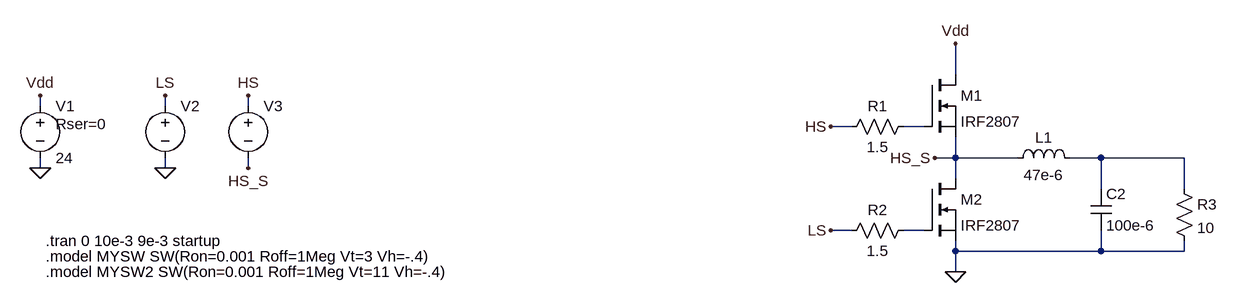
[diagram p0: schematic gate-driver-simple.asc]
gate-driver-simple.asc, the LTspice schematic file:
Version 4
SHEET 1 1408 680
WIRE 688 -272 688 -320
WIRE -720 -224 -720 -240
WIRE -528 -224 -528 -240
WIRE -400 -224 -400 -240
WIRE 528 -192 496 -192
WIRE 640 -192 608 -192
WIRE 688 -144 688 -176
WIRE 688 -144 656 -144
WIRE 784 -144 688 -144
WIRE 912 -144 864 -144
WIRE 1040 -144 912 -144
WIRE -720 -128 -720 -144
WIRE -528 -128 -528 -144
WIRE -400 -128 -400 -144
WIRE 688 -112 688 -144
WIRE 912 -96 912 -144
WIRE 1040 -96 1040 -144
WIRE 528 -32 496 -32
WIRE 640 -32 608 -32
WIRE 688 0 688 -16
WIRE 912 0 912 -32
WIRE 912 0 688 0
WIRE 1040 0 1040 -16
WIRE 1040 0 912 0
WIRE 688 32 688 0
FLAG 688 32 0
FLAG -720 -240 Vdd
FLAG -720 -128 0
FLAG 688 -320 Vdd
FLAG -528 -128 0
FLAG -528 -240 LS
FLAG -400 -240 HS
FLAG 496 -32 LS
FLAG 656 -144 HS_S
FLAG -400 -128 HS_S
FLAG 496 -192 HS
SYMBOL res 624 -208 R90
WINDOW 0 0 56 VBottom 2
WINDOW 3 32 56 VTop 2
SYMATTR InstName R1
SYMATTR Value 1.5
SYMBOL res 624 -48 R90
WINDOW 0 0 56 VBottom 2
WINDOW 3 32 56 VTop 2
SYMATTR InstName R2
SYMATTR Value 1.5
SYMBOL nmos 640 -272 R0
SYMATTR InstName M1
SYMATTR Value IRF2807
SYMBOL voltage -720 -240 R0
WINDOW 123 0 0 Left 0
WINDOW 39 24 44 Left 2
SYMATTR SpiceLine Rser=0
SYMATTR InstName V1
SYMATTR Value 24
SYMBOL res 1024 -112 R0
SYMATTR InstName R3
SYMATTR Value 10
SYMBOL ind 768 -128 R270
WINDOW 0 32 56 VTop 2
WINDOW 3 5 56 VBottom 2
SYMATTR InstName L1
SYMATTR Value 47e-6
SYMBOL cap 896 -96 R0
SYMATTR InstName C2
SYMATTR Value 100e-6
SYMBOL voltage -528 -240 R0
WINDOW 3 24 96 Invisible 2
WINDOW 123 0 0 Left 0
SYMATTR Value PULSE(12 0 0 1e-9 1e-9 5e-6 10e-6)
SYMATTR SpiceLine Rser=1e-3
SYMATTR InstName V2
SYMBOL voltage -400 -240 R0
WINDOW 3 24 96 Invisible 2
WINDOW 123 0 0 Left 0
SYMATTR Value PULSE(0 12 0.1e-6 0.1e-9 0.1e-9 4.8e-6 10e-6)
SYMATTR SpiceLine Rser=1e-3
SYMATTR InstName V3
SYMBOL nmos 640 -112 R0
SYMATTR InstName M2
SYMATTR Value IRF2807
TEXT -712 -16 Left 2 !.tran 0 10e-3 9e-3 startup
TEXT -712 8 Left 2 !.model MYSW SW(Ron=0.001 Roff=1Meg Vt=3 Vh=-.4)
TEXT -712 32 Left 2 !.model MYSW2 SW(Ron=0.001 Roff=1Meg Vt=11 Vh=-.4)

The netlist it stands for:
* gate-driver-simple.asc
R1 N001 HS 1.5
R2 N003 LS 1.5
M1 Vdd N001 HS_S HS_S IRF2807
V1 Vdd 0 24 Rser=0
R3 N002 0 10
L1 HS_S N002 47e-6
C2 N002 0 100e-6
V2 LS 0 PULSE(12 0 0 1e-9 1e-9 5e-6 10e-6) Rser=1e-3
V3 HS HS_S PULSE(0 12 0.1e-6 0.1e-9 0.1e-9 4.8e-6 10e-6) Rser=1e-3
M2 HS_S N003 0 0 IRF2807
.model NMOS NMOS
.model PMOS PMOS
.lib standard.mos
.tran 0 10e-3 9e-3 startup
.model MYSW SW(Ron=0.001 Roff=1Meg Vt=3 Vh=-.4)
.model MYSW2 SW(Ron=0.001 Roff=1Meg Vt=11 Vh=-.4)
.backanno
.end